# Altium schematic sheet Power.SchDoc
size A4
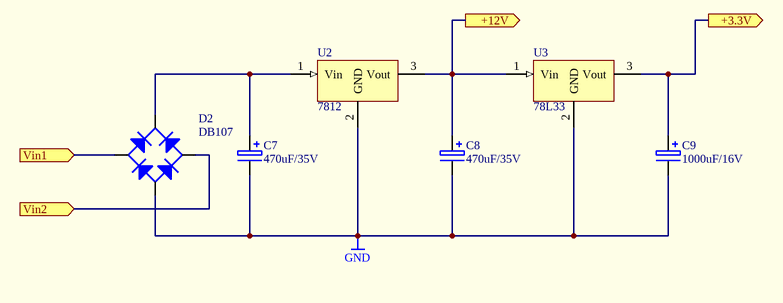
[diagram p0: Power.SchDoc]

## Parts
C7  470uF/35V  [EC10x20]
C8  470uF/35V  [EC8x16]
C9  1000uF/16V  [EC6.3x12]
D2  DB107  [BRIDGE_PTH]
U2  7812  [TO-220-V]
U3  78L33  [IC_TO-92]

## Ports
+3.3V (out), +12V (out), Vin1 (in), Vin2 (in)

## Nets
GND: C7.2 C8.2 C9.2 D2.4(M) U2.2(GND) U3.2(GND)
+3.3V: C9.1 U3.3(Vout) ; port +3.3V
+12V: C8.1 U2.3(Vout) U3.1(Vin) ; port +12V
Vin1: D2.1(AC1) ; port Vin1
Vin2: D2.2(AC2) ; port Vin2
NetC7_1: C7.1 D2.3(P) U2.1(Vin)

## Library data of the parts
C7-C9 = ELECTRO1: Electrolytic Capacitor
D2 = BRIDGE
U2 U3 = 78XX